# EAGLE design ethernet_granit (EAGLE 9.2.2)
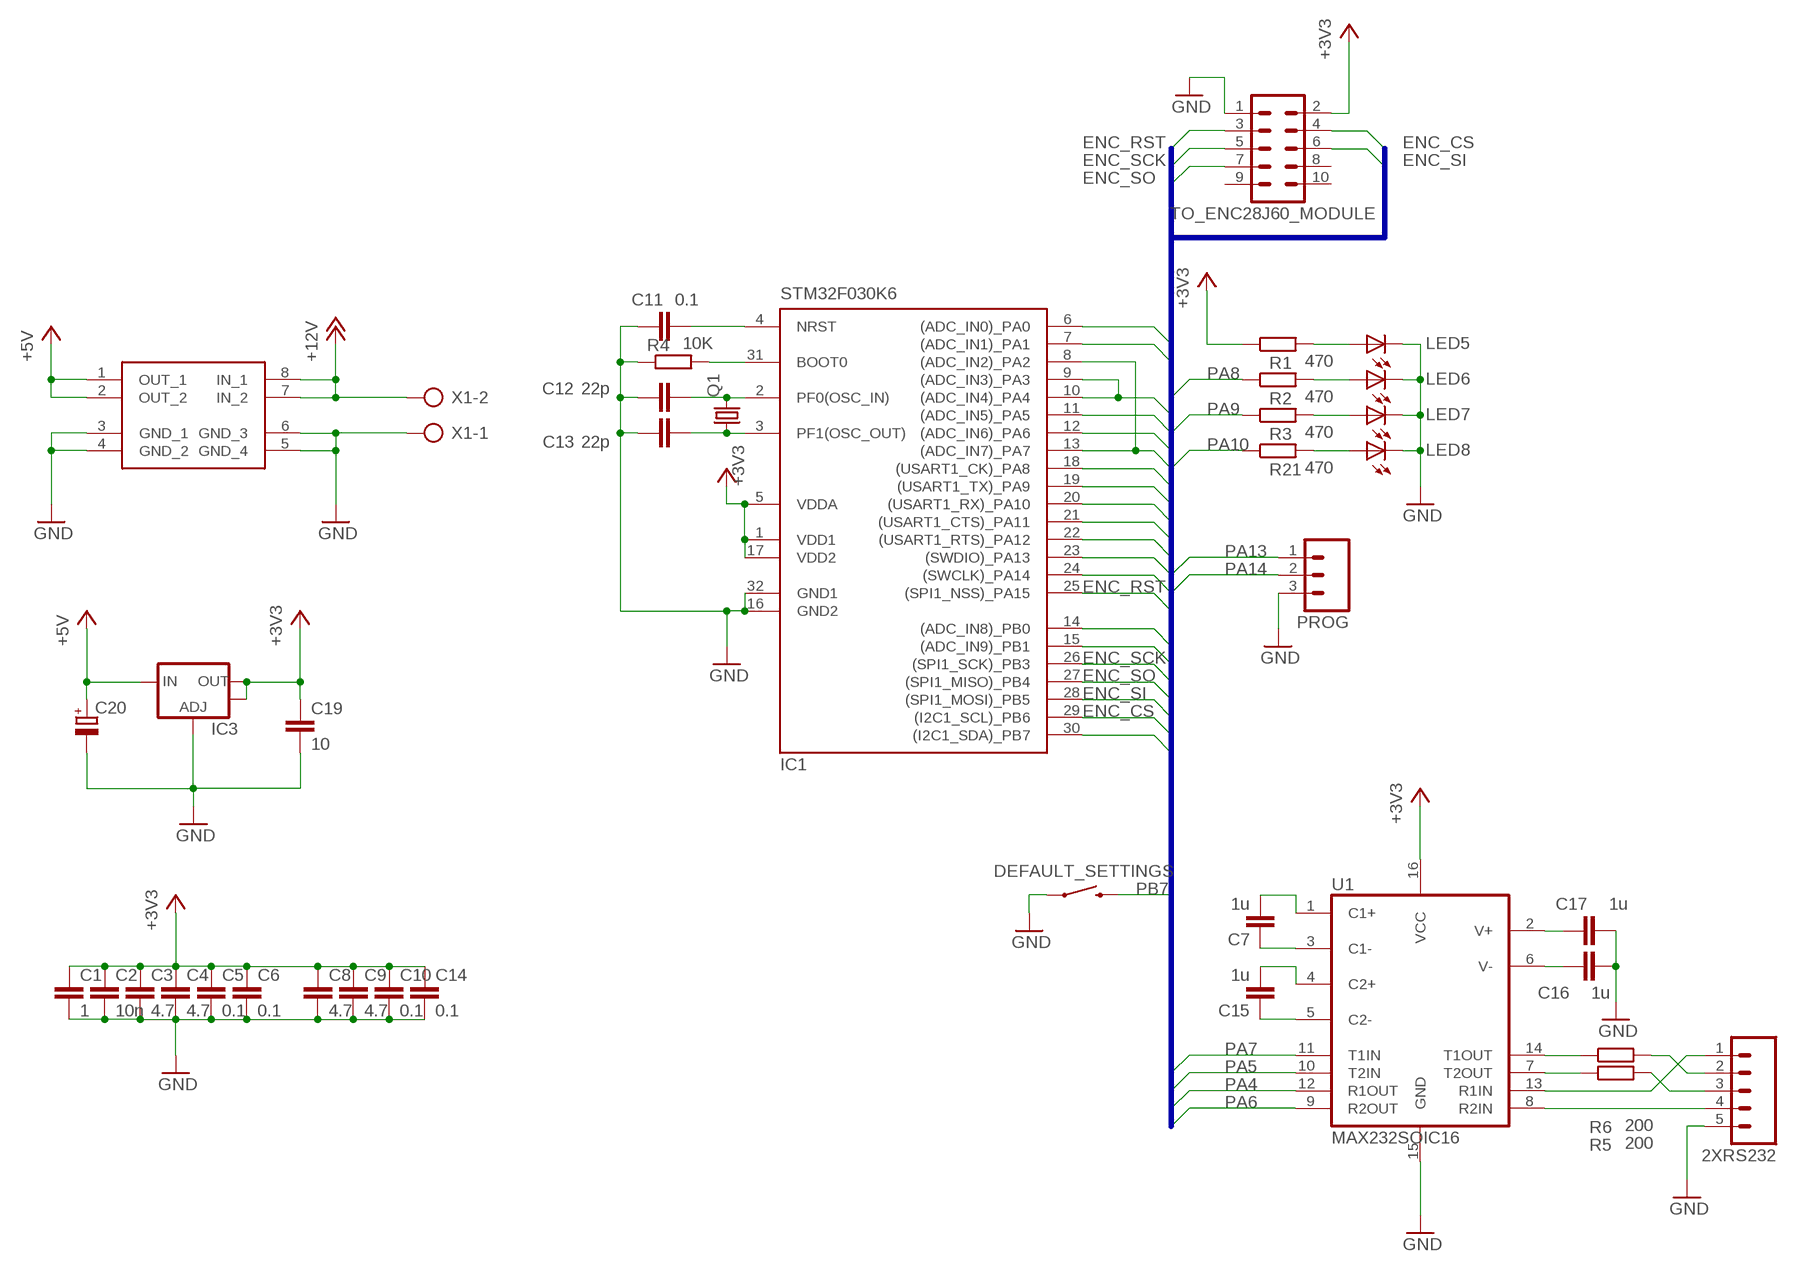
[diagram p0: schematic, sheet 1]

## Parts
2XRS232  M05  [05P]
C1  1  C-EUC0805  [C0805]
C2  10n  C-EUC0805  [C0805]
C3  4.7  C-EUC0805  [C0805]
C4  4.7  C-EUC0805  [C0805]
C5  0.1  C-EUC0805  [C0805]
C6  0.1  C-EUC0805  [C0805]
C7  1u  C-EUC0805  [C0805]
C8  4.7  C-EUC0805  [C0805]
C9  4.7  C-EUC0805  [C0805]
C10  0.1  C-EUC0805  [C0805]
C11  0.1  C-EUC0805  [C0805]
C12  22p  C-EUC0805  [C0805]
C13  22p  C-EUC0805  [C0805]
C14  0.1  C-EUC0805  [C0805]
C15  1u  C-EUC0805  [C0805]
C16  1u  C-EUC0805  [C0805]
C17  1u  C-EUC0805  [C0805]
C19  10  C-EUC0805  [C0805]
C20  CPOL-EUSMCC  [SMC_C]
DEFAULT_SETTINGS  SWITCH-MOMENTARY-2SIDE_EZ  [TACTILE-PTH-SIDEEZ]
IC1  STM32F030K6  [TQFP32-08]
IC3  V_REG_LM1117SOT223  [SOT223]
LED5  TLLG4400  [LED3MM]
LED6  TLLG4400  [LED3MM]
LED7  TLLG4400  [LED3MM]
LED8  TLLG4400  [LED3MM]
PROG  M03  [03P]
Q1  CRYSTALHC49S  [HC49/S]
R1  470  R-EU_R0805  [R0805]
R2  470  R-EU_R0805  [R0805]
R3  470  R-EU_R0805  [R0805]
R4  10K  R-EU_R0805  [R0805]
R5  200  R-EU_R0805  [R0805]
R6  200  R-EU_R0805  [R0805]
R21  470  R-EU_R0805  [R0805]
TO_ENC28J60_MODULE  ML10L  [ML10L]
U1  MAX232SOIC16  [SO016]
U$1  MP1584_MODUL  [MP1584_MODUL]
X1  AK300/2  [AK300/2]

## Nets
+3V3: C1.1 C2.1 C3.1 C4.1 C5.1 C6.1 C8.1 C9.1 C10.1 C14.1 C19.1 IC1.1(VDD1) IC1.5(VDDA) IC1.17(VDD2) IC3.2(OUT) IC3.4(OUT) R1.1 TO_ENC28J60_MODULE.2 U1.16(VCC)
+5V: C20.+ IC3.3(IN) U$1.1(OUT_1) U$1.2(OUT_2)
+12V: U$1.7(IN_2) U$1.8(IN_1) X1.2
ENC_CS: IC1.29((I2C1_SCL)_PB6) TO_ENC28J60_MODULE.4
ENC_RST: IC1.25((SPI1_NSS)_PA15) TO_ENC28J60_MODULE.3
ENC_SCK: IC1.26((SPI1_SCK)_PB3) TO_ENC28J60_MODULE.5
ENC_SI: IC1.28((SPI1_MOSI)_PB5) TO_ENC28J60_MODULE.6
ENC_SO: IC1.27((SPI1_MISO)_PB4) TO_ENC28J60_MODULE.7
GND: 2XRS232.5 C1.2 C2.2 C3.2 C4.2 C5.2 C6.2 C8.2 C9.2 C10.2 C11.1 C12.1 C13.1 C14.2 C16.1 C17.1 C19.2 C20.- DEFAULT_SETTINGS.1 IC1.16(GND2) IC1.32(GND1) IC3.1(ADJ) LED5.K(C) LED6.K(C) LED7.K(C) LED8.K(C) PROG.3 R4.1 TO_ENC28J60_MODULE.1 U1.15(GND) U$1.3(GND_1) U$1.4(GND_2) U$1.5(GND_4) U$1.6(GND_3) X1.1
N$1: C7.1 U1.3(C1-)
N$2: C7.2 U1.1(C1+)
N$3: C12.2 IC1.2(PF0(OSC_IN)) Q1.2
N$4: C13.2 IC1.3(PF1(OSC_OUT)) Q1.1
N$5: C15.1 U1.5(C2-)
N$6: C15.2 U1.4(C2+)
N$7: IC1.31(BOOT0) R4.2
N$8: C17.2 U1.2(V+)
N$9: C16.2 U1.6(V-)
N$10: LED5.A R1.2
N$11: R6.1 U1.14(T1OUT)
N$12: 2XRS232.3 R5.2
N$13: R5.1 U1.7(T2OUT)
N$14: 2XRS232.4 U1.8(R2IN)
N$15: LED6.A R2.2
N$16: LED7.A R3.2
N$17: LED8.A R21.2
N$18: 2XRS232.2 R6.2
N$19: 2XRS232.1 U1.13(R1IN)
N$20: C11.2 IC1.4(NRST)
PA0: IC1.6((ADC_IN0)_PA0)
PA1: IC1.7((ADC_IN1)_PA1)
PA4: IC1.9((ADC_IN3)_PA3) IC1.10((ADC_IN4)_PA4) U1.12(R1OUT)
PA5: IC1.11((ADC_IN5)_PA5) U1.10(T2IN)
PA6: IC1.12((ADC_IN6)_PA6) U1.9(R2OUT)
PA7: IC1.8((ADC_IN2)_PA2) IC1.13((ADC_IN7)_PA7) U1.11(T1IN)
PA8: IC1.18((USART1_CK)_PA8) R2.1
PA9: IC1.19((USART1_TX)_PA9) R3.1
PA10: IC1.20((USART1_RX)_PA10) R21.1
PA11: IC1.21((USART1_CTS)_PA11)
PA12: IC1.22((USART1_RTS)_PA12)
PA13: IC1.23((SWDIO)_PA13) PROG.1
PA14: IC1.24((SWCLK)_PA14) PROG.2
PB0: IC1.14((ADC_IN8)_PB0)
PB1: IC1.15((ADC_IN9)_PB1)
PB7: DEFAULT_SETTINGS.2 IC1.30((I2C1_SDA)_PB7)
Unconnected: TO_ENC28J60_MODULE.8 TO_ENC28J60_MODULE.9 TO_ENC28J60_MODULE.10

## Buses
ENC_RST,ENC_CS,ENC_SCK,ENC_SI,ENC_SO,PA[0..15],PB[0..7]

## Library data of the parts
2XRS232 = con-amp-quick:M05: AMP QUICK CONNECTOR; OC_FARNELL: unknown; OC_NEWARK: unknown
C1-C17 C19 = resistor:C-EU: CAPACITOR, European symbol; SPICEPREFIX: C
C20 = resistor:CPOL-EU: POLARIZED CAPACITOR, European symbol
DEFAULT_SETTINGS = SparkFun-Electromechanical:SWITCH-MOMENTARY-2: Various NO switches- pushbuttons, reed, etc
IC1 = my:STM32F030K6: MICROCONTROLLER 32 Kbytes FLASH, 4 kbytes SRAM, USART, SPI, 10-channel 12 bit ADC,
IC3 = SparkFun:V_REG_LM1117: Voltage Regulator LM1117 Standard adjustable voltage regulator but in SMD form. Spark Fun Electronics SKU : COM-00595
LED5-LED8 = led:TLLG4400: Low Current (2mA) LED 3 mm Tinted Diffused Package color GREEN Source: Data sheet <http://www.farnell.com/datasheets/391098.pdf>; MF: VISHAY SEMICONDUCTOR; OC_FARNELL: 1612435
PROG = con-amp-quick:M03: AMP QUICK CONNECTOR; OC_FARNELL: unknown; OC_NEWARK: unknown
Q1 = crystal:CRYSTAL: CRYSTAL; OC_FARNELL: 1667008; OC_NEWARK: unknown
R1-R6 R21 = resistor:R-EU_: RESISTOR, European symbol; SPICEPREFIX: R
TO_ENC28J60_MODULE = con-ml:ML10L: HARTING; OC_FARNELL: unknown; OC_NEWARK: unknown
U1 = SparkFun-DigitalIC:MAX232: RS232 Transceiver Very common IC. This is generically called 'MAX232', but works with the 3V equivalent MAX3232 generic ICs. Field tested and mother approved. Spark Fun Electronics SKU : COM-00316 (DIP) and COM-00589 (SMD); PROD_ID: IC-08171
U$1 = my_components:MP1584_MODUL
X1 = con-ptr500:AK300/2: CONNECTOR; OC_FARNELL: unknown; OC_NEWARK: unknown

## Board
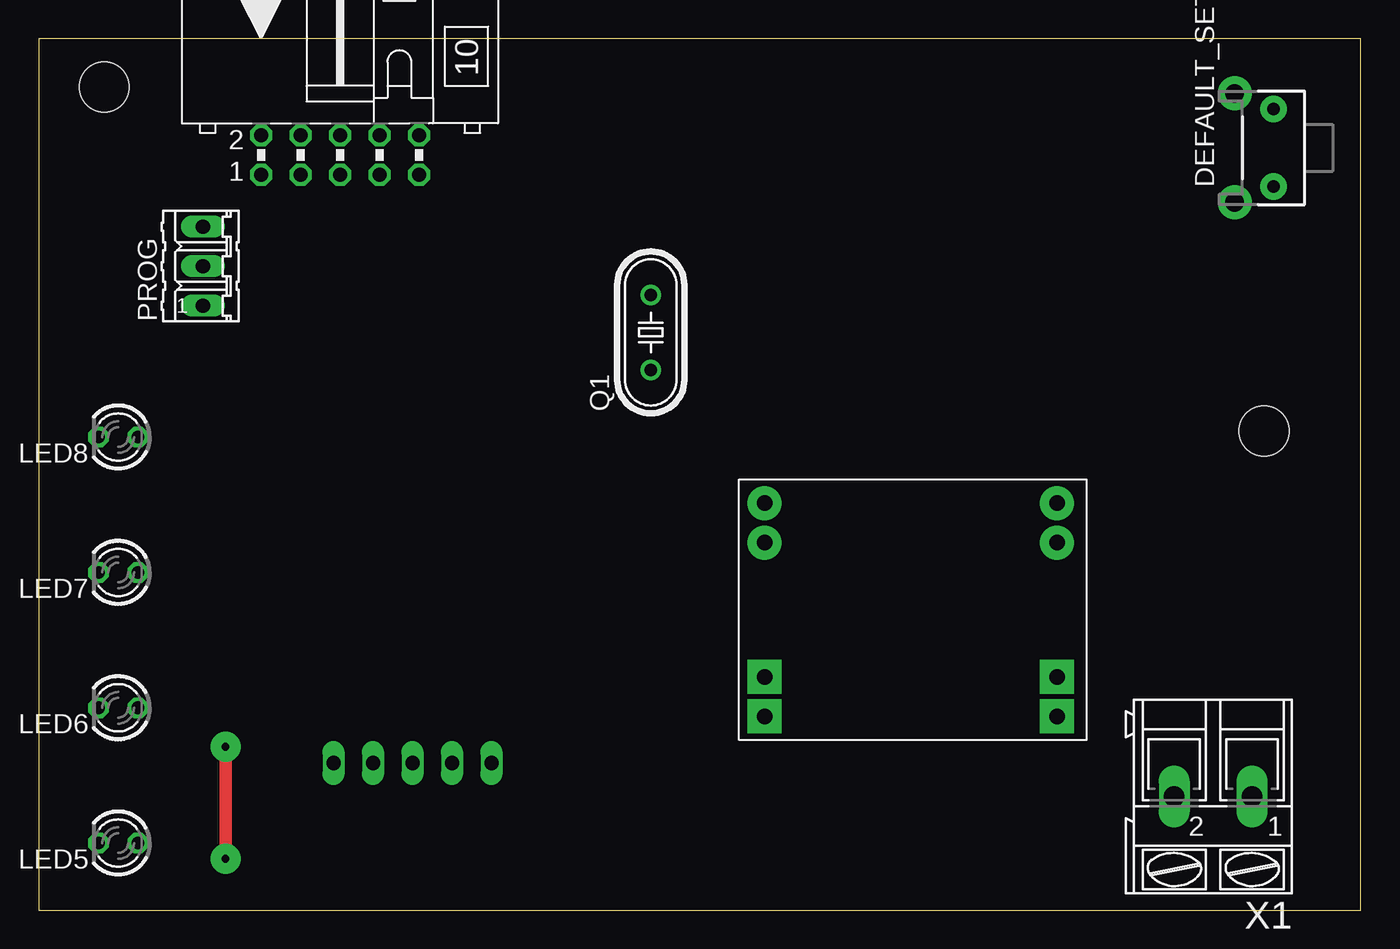
[diagram p1: board, top side]
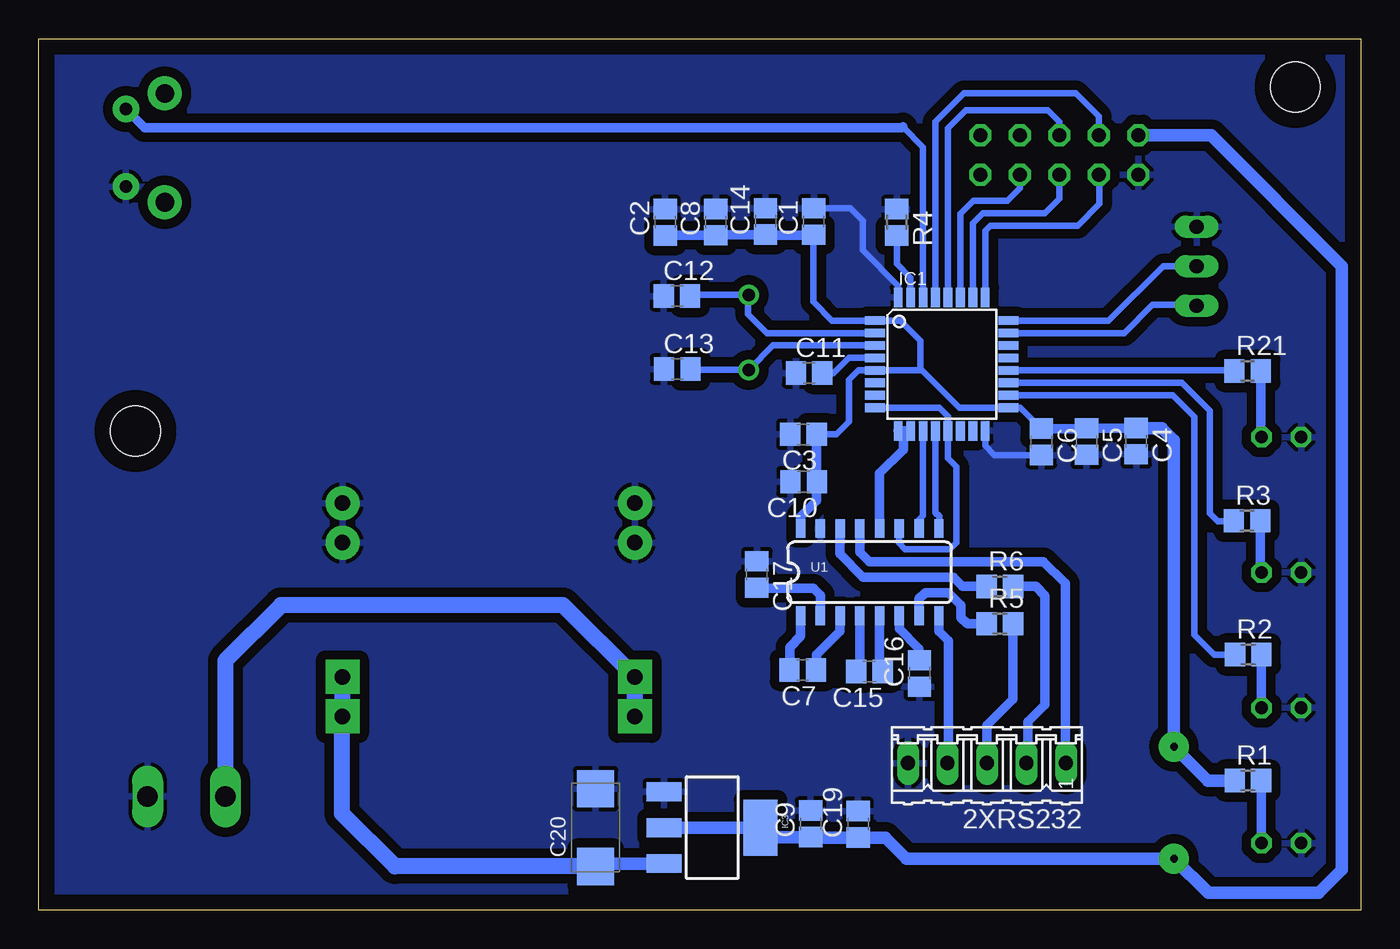
[diagram p2: board, bottom side, seen from below]

Size 85 x 56 mm. Coordinates in mm from the lower left corner, seen from the top.
Outline: 0,0 85,0 85,56 0,56 0,0
Copper layers (1*16): Top 0.035mm / dielectric 1.5mm / Bottom 0.035mm
Design rules "default": minimum track width 10mil, minimum drill 24mil, track to track 8mil, track to pad 8mil, pad to pad 8mil, via to via 8mil, smd to smd 8mil, copper to edge 40mil, drill to drill 8mil, minimum pad ring 10mil, minimum via ring 8mil, stop-mask expansion 4mil, vias tented up to drill 0mil, thermal gap 10mil
Holes 3.2 mm at 4.2,52.9 78.8,30.8

### Footprints (pad centres in the part's own frame; a part is rotated, then mirrored left to right if it is on the bottom)
05P = drill 0.914 long: 1 -5.08,0; 2 -2.54,0; 3 0,0; 4 2.54,0; 5 5.08,0
C0805 = smd 1.3 x 1.5: 1 -0.85,0; 2 0.85,0
SMC_C = smd 2.4 x 2.4: + -2.5,0; - 2.5,0
TACTILE-PTH-SIDEEZ = drill 0.8 pad 1.7: 1 -2.5,0; 2 2.5,0 | drill 1.2 pad 2.2: ANCHOR1 -3.5,2.5; ANCHOR2 3.5,2.5
TQFP32-08 = smd 1.27 x 0.559: 1 -4.293,2.8; 2 -4.293,2; 3 -4.293,1.2; 4 -4.293,0.4; 5 -4.293,-0.4; 6 -4.293,-1.2; 7 -4.293,-2; 8 -4.293,-2.8; 17 4.293,-2.8; 18 4.293,-2; 19 4.293,-1.2; 20 4.293,-0.4; 21 4.293,0.4; 22 4.293,1.2; 23 4.293,2; 24 4.293,2.8 | smd 0.559 x 1.27: 9 -2.8,-4.293; 10 -2,-4.293; 11 -1.2,-4.293; 12 -0.4,-4.293; 13 0.4,-4.293; 14 1.2,-4.293; 15 2,-4.293; 16 2.8,-4.293; 25 2.8,4.293; 26 2,4.293; 27 1.2,4.293; 28 0.4,4.293; 29 -0.4,4.293; 30 -1.2,4.293; 31 -2,4.293; 32 -2.8,4.293
SOT223 = smd 1.219 x 2.235: 1 -2.311,-3.099; 2 0,-3.099; 3 2.311,-3.099 | smd 3.6 x 2.2: 4 0,3.099
LED3MM = drill 0.813 octagon: A -1.27,0; K 1.27,0
03P = drill 0.914 long: 1 -2.54,0; 2 0,0; 3 2.54,0
HC49/S = drill 0.813: 1 -2.413,0; 2 2.413,0
R0805 = smd 1.3 x 1.5: 1 -0.85,0; 2 0.85,0
ML10L = drill 0.914 octagon: 1 -5.08,-1.27; 2 -5.08,1.27; 3 -2.54,-1.27; 4 -2.54,1.27; 5 0,-1.27; 6 0,1.27; 7 2.54,-1.27; 8 2.54,1.27; 9 5.08,-1.27; 10 5.08,1.27
SO016 = smd 0.6 x 1.2: 1 -4.445,-2.8; 2 -3.175,-2.8; 3 -1.905,-2.8; 4 -0.635,-2.8; 5 0.635,-2.8; 6 1.905,-2.8; 7 3.175,-2.8; 8 4.445,-2.8; 9 4.445,2.8; 10 3.175,2.8; 11 1.905,2.8; 12 0.635,2.8; 13 -0.635,2.8; 14 -1.905,2.8; 15 -3.175,2.8; 16 -4.445,2.8
MP1584_MODUL = drill 1 pad 2.184 square: 1 -9.271,6.858; 2 -9.271,4.318; 7 9.525,4.318; 8 9.525,6.858 | drill 1 pad 2.184: 3 -9.271,-4.318; 4 -9.271,-6.858; 5 9.525,-6.858; 6 9.525,-4.318
AK300/2 = drill 1.321 long: 1 -2.515,0; 2 2.489,0

### Placement (x,y rotation side)
2XRS232  24.03,9.45 180 bottom
C1  35.17,44.26 90 bottom
C2  44.72,44.21 90 bottom
C3  35.83,30.58 180 bottom
C4  14.43,30.14 270 bottom
C5  17.63,30.12 270 bottom
C6  20.53,30.1 270 bottom
C7  35.88,15.43 180 bottom
C8  41.47,44.22 90 bottom
C9  35.37,5.54 90 bottom
C10  35.81,27.53 180 bottom
C11  35.47,34.52 0 bottom
C12  43.97,39.47 0 bottom
C13  43.95,34.77 0 bottom
C14  38.27,44.27 90 bottom
C15  31.59,15.33 180 bottom
C16  28.37,15.21 90 bottom
C17  38.83,21.57 270 bottom
C19  32.32,5.51 90 bottom
C20  49.2,5.3 90 bottom
DEFAULT_SETTINGS  79.4,49 90 top
IC1  26.94,35.09 0 bottom
IC3  41.7,5.3 270 bottom
LED5  5.1,4.3 180 top
LED6  5.1,13 180 top
LED7  5.1,21.7 180 top
LED8  5.1,30.4 180 top
PROG  10.55,41.39 90 top
Q1  39.35,37.13 90 top
R1  7.25,8.32 0 bottom
R2  7.23,16.42 0 bottom
R3  7.31,25.02 0 bottom
R4  29.83,44.21 270 bottom
R5  23.2,18.4 0 bottom
R6  23.2,20.8 0 bottom
R21  7.27,34.65 0 bottom
TO_ENC28J60_MODULE  19.37,48.54 0 top
U1  31.57,21.72 0 bottom
U$1  56.2,19.3 180 top
X1  75.5,7.3 180 top

### Tracks (layer width: path | path; a pad name or v marks a point on that pad's centre or on a via)
+3V3  (via drill 0.5 pad 1.93)
  Top 0.813: v12,3.3 v12,10.5
  Bottom 0.406: 28.4,34.7 28.2,34.7 25.79,32.29 IC1.17 21.87,32.29 C6.1 | 28.4,34.7 IC1.5 32.31,34.69 32.9,34.1 32.9,31.4 33.7,30.6 34.96,30.6 C3.1 | 28.4,34.7 28.3,34.8 28.3,36.6 29.59,37.89 IC1.1 33.99,37.89 35.2,39.1 35.2,43.38 C1.1
  Bottom 0.61: C6.1 17.65,30.95 C5.1 14.45,30.97 C4.1 | 35.2,43.38 38.23,43.38 C14.1 41.42,43.42 C8.1 C2.1 | C3.1 34.98,27.55 C10.1 35,27.49 35,26.3 36.02,25.29 U1.16 | C19.1 32.35,4.69
  Bottom 0.813: 14.45,30.97 12.77,30.97 12,30.2 v12,10.5 9.82,8.32 R1.1 | IC3.2 IC3.4 37.99,4.69 C9.1 35.34,4.66 C19.1 30.56,4.66 29.2,3.3 v12,3.3 9.8,1.1 2.7,1.1 1.2,2.6 1.2,41.4 9.61,49.81 TO_ENC28J60_MODULE.2
+5V
  Bottom 0.813: IC3.3 49.01,2.99 C20.+
  Bottom 1.016: C20.+ 62.1,2.8 65.5,6.2 65.5,12.41 U$1.1 U$1.2
+12V
  Bottom 1.016: U$1.8 U$1.7 51.29,19.6 69.42,19.6 73.01,16.01 X1.2
ENC_CS
  Bottom 0.406: IC1.29 27.34,50.66 25.5,52.5 18.3,52.5 16.83,51.03 TO_ENC28J60_MODULE.4
ENC_RST
  Bottom 0.406: IC1.25 24.14,43.66 23.8,44 18.2,44 16.8,45.4 16.8,47.24 TO_ENC28J60_MODULE.3
ENC_SCK
  Bottom 0.406: IC1.26 24.94,44.16 24.3,44.8 20.3,44.8 19.37,45.73 TO_ENC28J60_MODULE.5
ENC_SI
  Bottom 0.406: IC1.28 26.54,50.26 25.4,51.4 20.1,51.4 19.37,50.67 TO_ENC28J60_MODULE.6
ENC_SO
  Bottom 0.406: IC1.27 25.74,44.76 24.9,45.6 22.7,45.6 21.91,46.39 TO_ENC28J60_MODULE.7
GND
  Bottom 0.406: IC1.16 24.14,29.84 23.55,29.25 C6.2 | IC1.32 29.74,40.14 32,42.4 32,44.3 32.81,45.11 C1.2
  pour Bottom (isolate 0.61): 0.6,55.5 84.5,55.5 84.5,0.4 0.6,0.4
N$1
  Bottom 0.61: U1.3 33.48,17.93 35,16.4 35,15.46 C7.1
N$2
  Bottom 0.61: U1.1 36.02,17.59 36.7,16.9 36.7,15.46 C7.2
N$3
  Bottom 0.406: IC1.2 38.19,37.09 39.4,38.3 39.4,39.49 Q1.2 43.05,39.54 C12.2
N$4
  Bottom 0.406: IC1.3 37.78,36.29 Q1.1 43.05,34.72 C13.2
N$5
  Bottom 0.61: U1.5 30.93,15.53 C15.1
N$6
  Bottom 0.61: U1.4 32.2,15.56 C15.2
N$7
  Bottom 0.406: IC1.31 28.94,40.64 29.83,41.53 R4.2
N$8
  Bottom 0.61: U1.2 34.74,20.25 35.2,20.7 38.81,20.7 C17.2
N$9
  Bottom 0.61: U1.6 29.66,18.07 28.4,16.8 28.4,16.09 C16.2
N$10
  Bottom 0.61: R1.2 6.4,4.33 LED5.A
N$11
  Bottom 0.61: R6.1 25.6,20.8 26.2,21.4 32,21.4 33.5,22.9 33.5,24.5 U1.14
N$12
  Bottom 0.61: R5.2 22.35,13.55 24.03,11.87 2XRS232.3
N$13
  Bottom 0.61: U1.7 28.39,20 28,20.4 26.5,20.4 25.7,19.6 25.7,18.8 25.3,18.4 R5.1
N$14
  Bottom 0.61: U1.8 27.12,17.93 26.5,17.3 26.5,9.52 2XRS232.4
N$15
  Bottom 0.61: R2.2 LED6.A
N$16
  Bottom 0.61: R3.2 6.46,21.79 LED7.A
N$17
  Bottom 0.61: R21.2 6.42,30.45 LED8.A
N$18
  Bottom 0.61: R6.2 20.9,20.8 20.3,20.2 20.3,13.2 21.4,12.1 21.4,9.54 2XRS232.2
N$19
  Bottom 0.61: U1.13 32.2,23 31.6,22.4 20.4,22.4 19,21 19,9.5 2XRS232.1
N$20
  Bottom 0.406: IC1.4 32.91,35.49 33.9,34.5 34.6,34.5 C11.2
PA4
  Bottom 0.61: IC1.10 IC1.9 29.4,30.46 29.4,29.6 30.93,28.07 U1.12
PA5
  Bottom 0.406: IC1.11 28.14,25.36 28.4,25.1 U1.10
PA6
  Bottom 0.406: IC1.12 27.34,25.54 27.1,25.3 27.1,24.55 U1.9
PA7
  Bottom 0.406: U1.11 29.7,24.48 29.7,23.6 29.3,23.2 26.4,23.2 26,23.6 26,28.5 26.54,29.04 IC1.13 26.54,31.74 27.1,32.3 IC1.8
PA8
  Bottom 0.406: IC1.18 12.09,33.09 10.7,31.7 10.7,17.7 9.4,16.4 9.38,16.42 R2.1
PA9
  Bottom 0.406: IC1.19 11.49,33.89 9.7,32.1 9.7,25.5 9.2,25 8.18,25 R3.1
PA10
  Bottom 0.406: R21.1 8.16,34.69 IC1.20
PA13
  Bottom 0.406: IC1.23 15.21,37.09 13.4,38.9 10.55,38.9 PROG.1
PA14
  Bottom 0.406: IC1.24 16.21,37.89 12.7,41.4 PROG.2
PB7
  Bottom 0.406: IC1.30 28.14,49.04 29.45,50.35
  Bottom 0.61: DEFAULT_SETTINGS.2 78.2,50.3 29.5,50.3 29.45,50.35